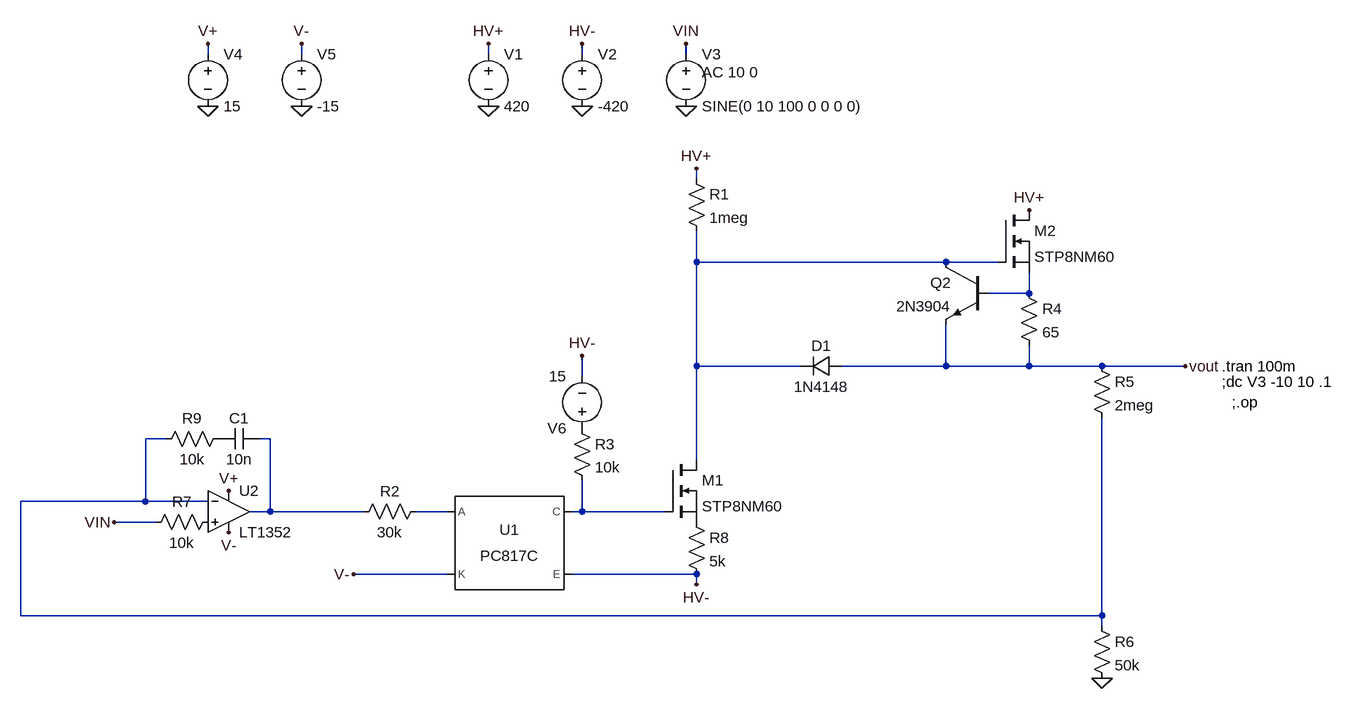
[diagram p0: schematic common source feedback.asc]
common source feedback.asc, the LTspice schematic file:
Version 4
SHEET 1 1216 932
WIRE -544 -208 -544 -224
WIRE -400 -208 -400 -224
WIRE -112 -208 -112 -224
WIRE 32 -208 32 -224
WIRE 192 -208 192 -224
WIRE 208 -16 208 -32
WIRE 208 112 208 64
WIRE 592 112 208 112
WIRE 672 112 592 112
WIRE 720 160 720 128
WIRE 720 160 656 160
WIRE 208 272 208 112
WIRE 368 272 208 272
WIRE 592 272 592 208
WIRE 592 272 432 272
WIRE 720 272 720 240
WIRE 720 272 592 272
WIRE 832 272 720 272
WIRE 960 272 832 272
WIRE 32 288 32 256
WIRE -608 384 -640 384
WIRE -448 384 -464 384
WIRE 208 416 208 272
WIRE -640 480 -640 384
WIRE -640 480 -832 480
WIRE -544 480 -640 480
WIRE -448 496 -448 384
WIRE -448 496 -480 496
WIRE -304 496 -448 496
WIRE -176 496 -224 496
WIRE 32 496 32 448
WIRE 32 496 16 496
WIRE 160 496 32 496
WIRE -624 512 -688 512
WIRE -176 592 -320 592
WIRE 208 592 16 592
WIRE 208 608 208 592
WIRE -832 656 -832 480
WIRE 832 656 832 352
WIRE 832 656 -832 656
WIRE 832 672 832 656
FLAG -112 -128 0
FLAG 32 -128 0
FLAG 192 -128 0
FLAG -112 -224 HV+
FLAG 32 -224 HV-
FLAG 192 -224 VIN
FLAG 208 -32 HV+
FLAG -544 -128 0
FLAG -400 -128 0
FLAG -544 -224 V+
FLAG -400 -224 V-
FLAG 960 272 vout
FLAG 208 608 HV-
FLAG 32 256 HV-
FLAG -320 592 V-
FLAG 720 32 HV+
FLAG 832 752 0
FLAG -512 464 V+
FLAG -512 528 V-
FLAG -688 512 VIN
SYMBOL voltage -112 -224 R0
WINDOW 123 0 0 Left 2
WINDOW 39 0 0 Left 2
SYMATTR InstName V1
SYMATTR Value 420
SYMBOL voltage 32 -224 R0
WINDOW 123 0 0 Left 2
WINDOW 39 0 0 Left 2
SYMATTR InstName V2
SYMATTR Value -420
SYMBOL voltage 192 -224 R0
WINDOW 123 24 44 Left 2
WINDOW 39 0 0 Left 2
SYMATTR Value2 AC 10 0
SYMATTR InstName V3
SYMATTR Value SINE(0 10 100 0 0 0 0)
SYMBOL voltage -544 -224 R0
WINDOW 123 0 0 Left 2
WINDOW 39 0 0 Left 2
SYMATTR InstName V4
SYMATTR Value 15
SYMBOL voltage -400 -224 R0
WINDOW 123 0 0 Left 2
WINDOW 39 0 0 Left 2
SYMATTR InstName V5
SYMATTR Value -15
SYMBOL res 192 -32 R0
SYMATTR InstName R1
SYMATTR Value 1meg
SYMBOL res 192 496 R0
SYMATTR InstName R8
SYMATTR Value 5k
SYMBOL nmos 160 416 R0
SYMATTR InstName M1
SYMATTR Value STP8NM60
SYMBOL res -208 480 R90
WINDOW 0 0 56 VBottom 2
WINDOW 3 32 56 VTop 2
SYMATTR InstName R2
SYMATTR Value 30k
SYMBOL voltage 32 384 R180
WINDOW 123 0 0 Left 2
WINDOW 39 0 0 Left 2
SYMATTR InstName V6
SYMATTR Value 15
SYMBOL Optos\\PC817C -80 544 R0
SYMATTR InstName U1
SYMBOL res 16 352 R0
SYMATTR InstName R3
SYMATTR Value 10k
SYMBOL nmos 672 32 R0
SYMATTR InstName M2
SYMATTR Value STP8NM60
SYMBOL npn 656 112 M0
SYMATTR InstName Q2
SYMATTR Value 2N3904
SYMBOL res 704 144 R0
SYMATTR InstName R4
SYMATTR Value 65
SYMBOL diode 432 256 R90
WINDOW 0 0 32 VBottom 2
WINDOW 3 32 32 VTop 2
SYMATTR InstName D1
SYMATTR Value 1N4148
SYMBOL res 816 256 R0
SYMATTR InstName R5
SYMATTR Value 2meg
SYMBOL res 816 656 R0
SYMATTR InstName R6
SYMATTR Value 50k
SYMBOL res -528 496 R90
WINDOW 0 0 56 VBottom 2
WINDOW 3 32 56 VTop 2
SYMATTR InstName R7
SYMATTR Value 10k
SYMBOL res -512 368 R90
WINDOW 0 0 56 VBottom 2
WINDOW 3 32 56 VTop 2
SYMATTR InstName R9
SYMATTR Value 10k
SYMBOL cap -464 368 R90
WINDOW 0 0 32 VBottom 2
WINDOW 3 32 32 VTop 2
SYMATTR InstName C1
SYMATTR Value 10n
SYMBOL Opamps\\LT1352 -512 432 R0
SYMATTR InstName U2
TEXT 1016 296 Left 2 !;dc V3 -10 10 .1
TEXT 1016 272 Left 2 !.tran 100m
TEXT 1032 328 Left 2 !;.op

The netlist it stands for:
* common source feedback.asc
V1 HV+ 0 420
V2 HV- 0 -420
V3 VIN 0 SINE(0 10 100 0 0 0 0) AC 10 0
V4 V+ 0 15
V5 V- 0 -15
R1 HV+ N001 1meg
R8 P001 HV- 5k
M1 N001 N006 P001 P001 STP8NM60
R2 N005 N004 30k
V6 P002 HV- 15
XU1 N005 V- N006 HV- PC817 Igain=2.3m  ; PC817C, pins A K C E
R3 P002 N006 10k
M2 HV+ N001 N002 N002 STP8NM60
Q2 N001 N002 vout 0 2N3904
R4 N002 vout 65
D1 vout N001 1N4148
R5 vout N003 2meg
R6 N003 0 50k
R7 P003 VIN 10k
R9 P004 N003 10k
C1 N004 P004 10n
XU2 P003 N003 V+ V- N004 LT1352  ; pins In+ In- V+ V- OUT
.model D D
.lib standard.dio
.model NPN NPN
.model PNP PNP
.lib standard.bjt
.model NMOS NMOS
.model PMOS PMOS
.lib standard.mos
;dc V3 -10 10 .1
.tran 100m
;.op
.lib PC817.sub
.lib LTC.lib
.backanno
.end